# EAGLE design try2 (EAGLE 9.5.2)
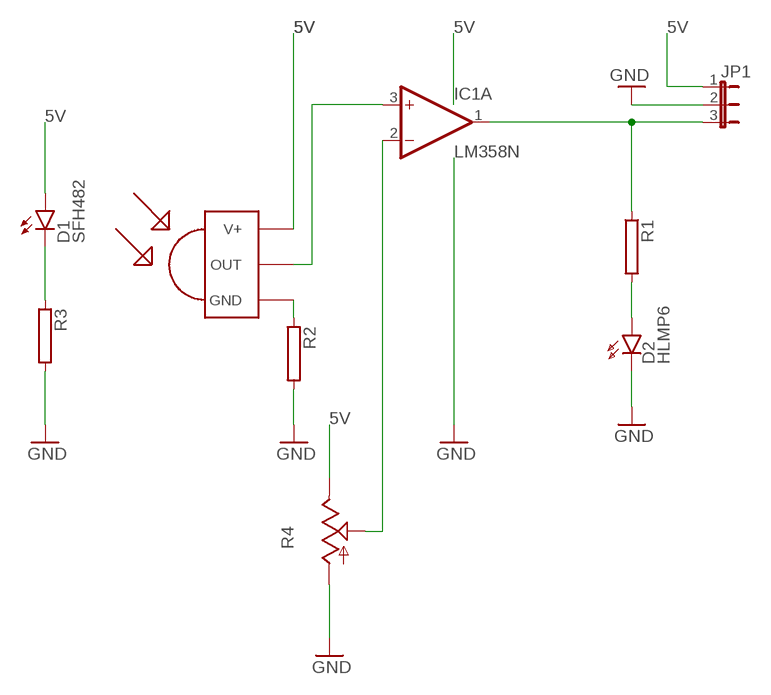
[diagram p0: schematic, sheet 1]

## Parts
D1  SFH482  [SFH482]
D2  HLMP6  [HLMP6]
IC1  LM358N  [DIL08]
JP1  JP2E  [JP2]
R1  RAC01  [AC01]
R2  RAC01  [AC01]
R3  RAC01  [AC01]
R4  TRIM_US-CA9H  [CA9H]
TSOP1  TSOP1730  [TSOP17XX]

## Nets
5V: D1.A R4.E TSOP1.V+
GND: D2.K JP1.2 R2.2 R3.2 R4.A
N$1: IC1.2(A:-IN) R4.S
N$2: D2.A R1.2
N$3: IC1.1(A:OUT) JP1.3 R1.1
N$5: JP1.1
N$6: R2.1 TSOP1.GND
N$7: IC1.3(A:+IN) TSOP1.OUT
N$8: D1.K(C) R3.1
Unconnected: IC1.5(B:+IN) IC1.6(B:-IN) IC1.7(B:OUT)

## Power pins joined to a net without a drawn wire
V+: IC1.8(P:V+)
V-: IC1.4(P:V-)

## Library data of the parts
D1 = led:SFH482: IR LED infrared emitting diode, Infineon
D2 = display-hp:HLMP6: LED 2mm horizontal; MF: AGILENT TECHNOLOGIES; MPN: HLMP-6500; OC_FARNELL: 1652490; OC_NEWARK: 40K0088
IC1 = linear3:LM358: OP AMP
JP1 = jumper:JP2E: JUMPER
R1-R3 = resistor-power:R: Power Resitor; OC_FARNELL: unknown; OC_NEWARK: unknown
R4 = pot:TRIM_US-: POTENTIOMETER
TSOP1 = tsop:TSOP1730: IR Receiver and Demodulator

## Board
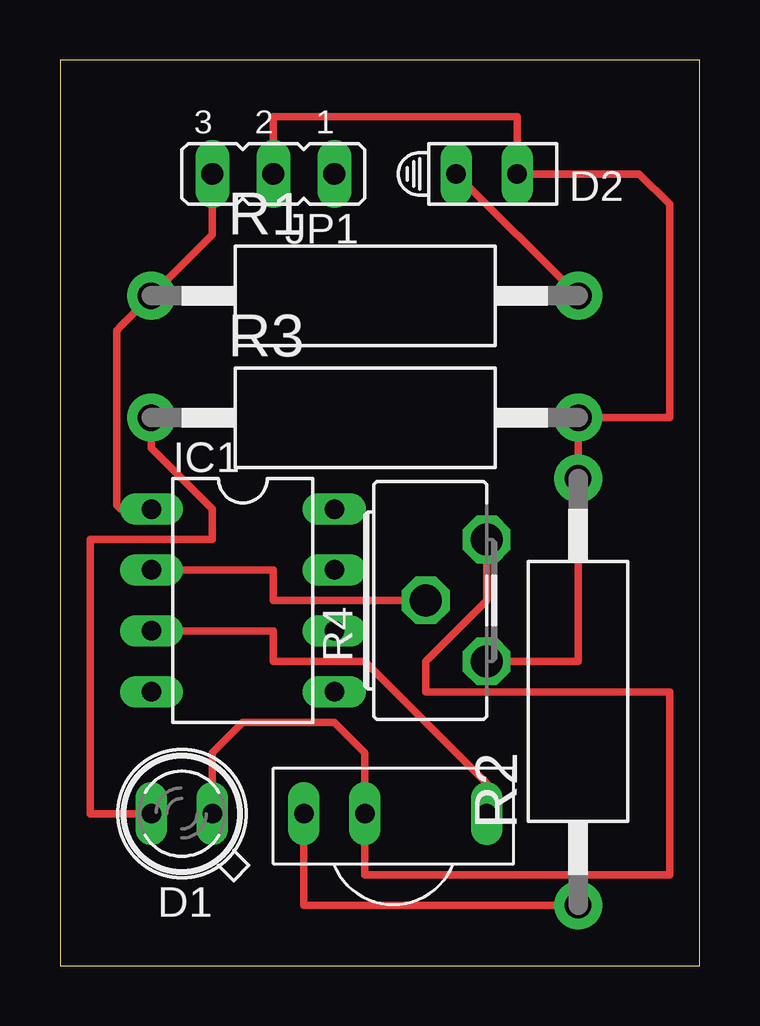
[diagram p1: board, top side]

Size 26.65 x 37.77 mm. Coordinates in mm from the lower left corner, seen from the top.
Outline: 0,0 26.65,0 26.65,37.77 0,37.77 0,0
Copper layers (1*16): Top 0.035mm / dielectric 1.5mm / Bottom 0.035mm
Design rules "default": minimum track width 6mil, minimum drill 0.35mm, track to track 6mil, track to pad 6mil, pad to pad 6mil, via to via 6mil, smd to smd 6mil, copper to edge 40mil, drill to drill 6mil, minimum pad ring 10mil, minimum via ring 8mil, stop-mask expansion 4mil, vias tented up to drill 0mil, thermal gap 10mil

### Footprints (pad centres in the part's own frame; a part is rotated, then mirrored left to right if it is on the bottom)
SFH482 = drill 0.813 long: A -1.27,0; K 1.27,0
HLMP6 = drill 0.813 long: A -1.27,0; K 1.27,0
DIL08 = drill 0.813 long: 1 -3.81,-3.81; 2 -1.27,-3.81; 3 1.27,-3.81; 4 3.81,-3.81; 5 3.81,3.81; 6 1.27,3.81; 7 -1.27,3.81; 8 -3.81,3.81
JP2 = drill 0.914 long: 1 -2.54,0; 2 0,0; 3 2.54,0
AC01 = drill 1.1 pad 2: 1 -8.9,0; 2 8.9,0
CA9H = drill 1.321 octagon: A -2.54,0; E 2.54,0; S 0,2.54
TSOP17XX = drill 0.813 long: GND -3.81,0; OUT 3.81,0; V+ -1.27,0

### Placement (x,y rotation side)
D1  5.08,6.35 180 top
D2  17.78,33.02 0 top
IC1  7.62,15.24 270 top
JP1  8.89,33.02 180 top
R1  12.7,27.94 0 top
R2  21.59,11.43 90 top
R3  12.7,22.86 0 top
R4  17.78,15.24 90 top
TSOP1  13.97,6.35 0 top

### Tracks (layer width: path | path; a pad name or v marks a point on that pad's centre or on a via)
5V
  Top 0.305: D1.A 6.35,8.89 7.62,10.16 11.43,10.16 12.7,8.89 TSOP1.V+ 12.7,3.81 25.4,3.81 25.4,11.43 15.24,11.43 15.24,12.7 17.78,15.24 R4.E
GND
  Top 0.152: R3.2
  Top 0.305: JP1.2 8.89,35.41 19.05,35.41 D2.K 24.13,33.02 25.4,31.75 25.4,22.86 R3.2 | R3.2 R2.2 21.59,12.7 R4.A
N$1
  Top 0.305: IC1.2 8.89,16.51 8.89,15.24 R4.S
N$2
  Top 0.152: R1.2
  Top 0.305: D2.A R1.2
N$3
  Top 0.152: R1.1
  Top 0.305: JP1.3 6.35,30.49 R1.1 | R1.1 2.54,26.67 2.36,26.49 2.36,19.23 2.54,19.05 IC1.1
N$6
  Top 0.152: 10.16,2.54 10.17,2.53
  Top 0.305: TSOP1.GND 10.16,2.54 | 10.17,2.53 R2.1
N$7
  Top 0.305: IC1.3 8.89,13.97 8.89,12.7 11.43,12.7 12.7,12.7 17.78,7.62 TSOP1.OUT
N$8
  Top 0.305: R3.1 3.8,21.6 6.35,19.05 6.35,17.78 1.27,17.78 1.27,6.35 D1.K